# Altium project H2_receiver_v1.PrjPcb
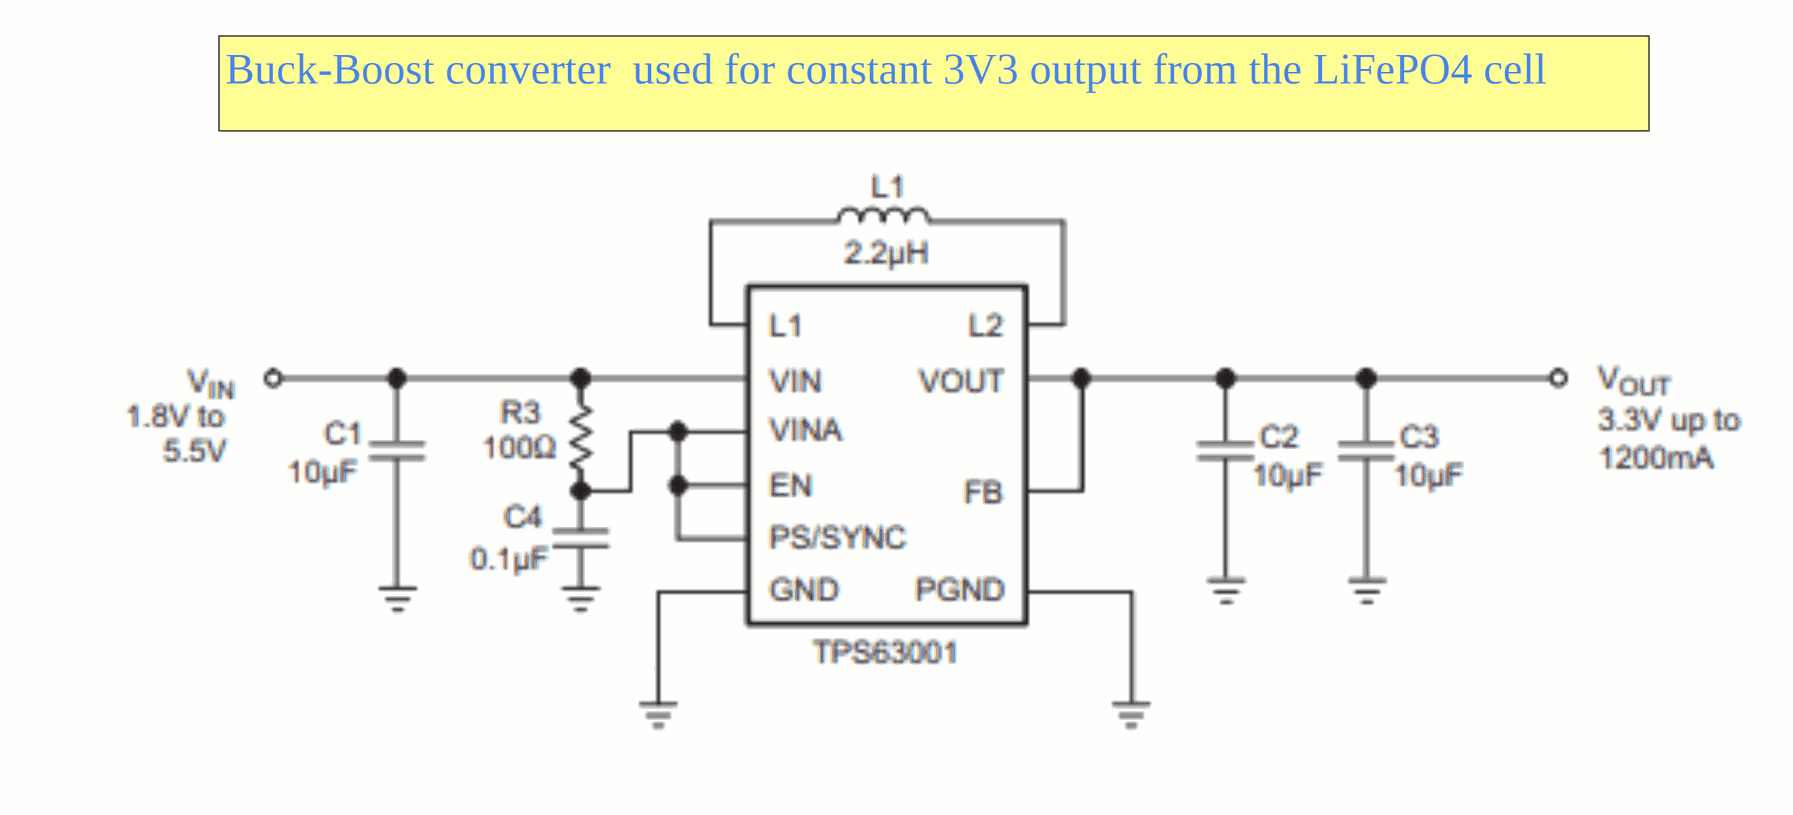
[diagram p0: 1_Power.SchDoc, top left]
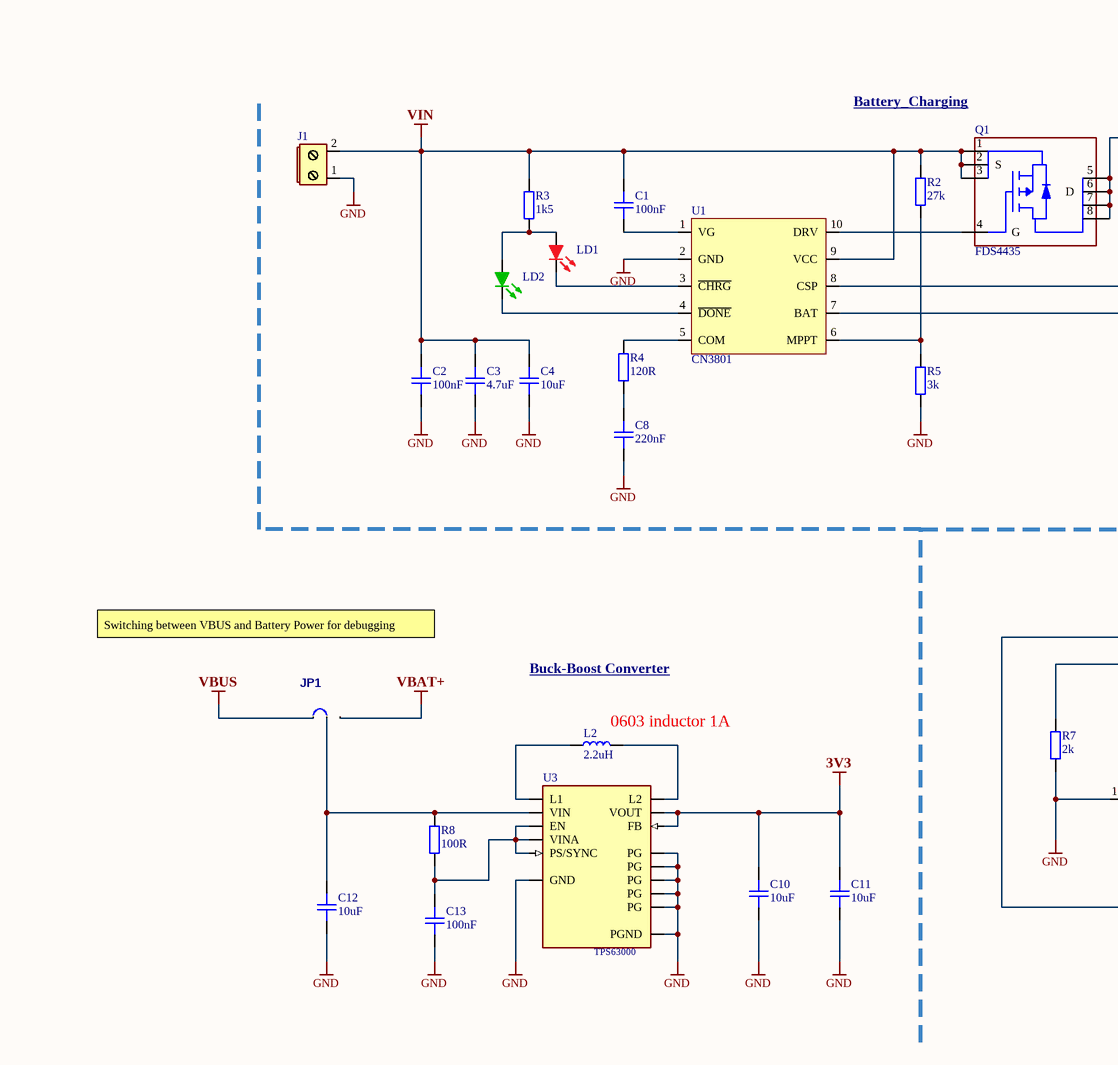
[diagram p1: 1_Power.SchDoc, top middle]
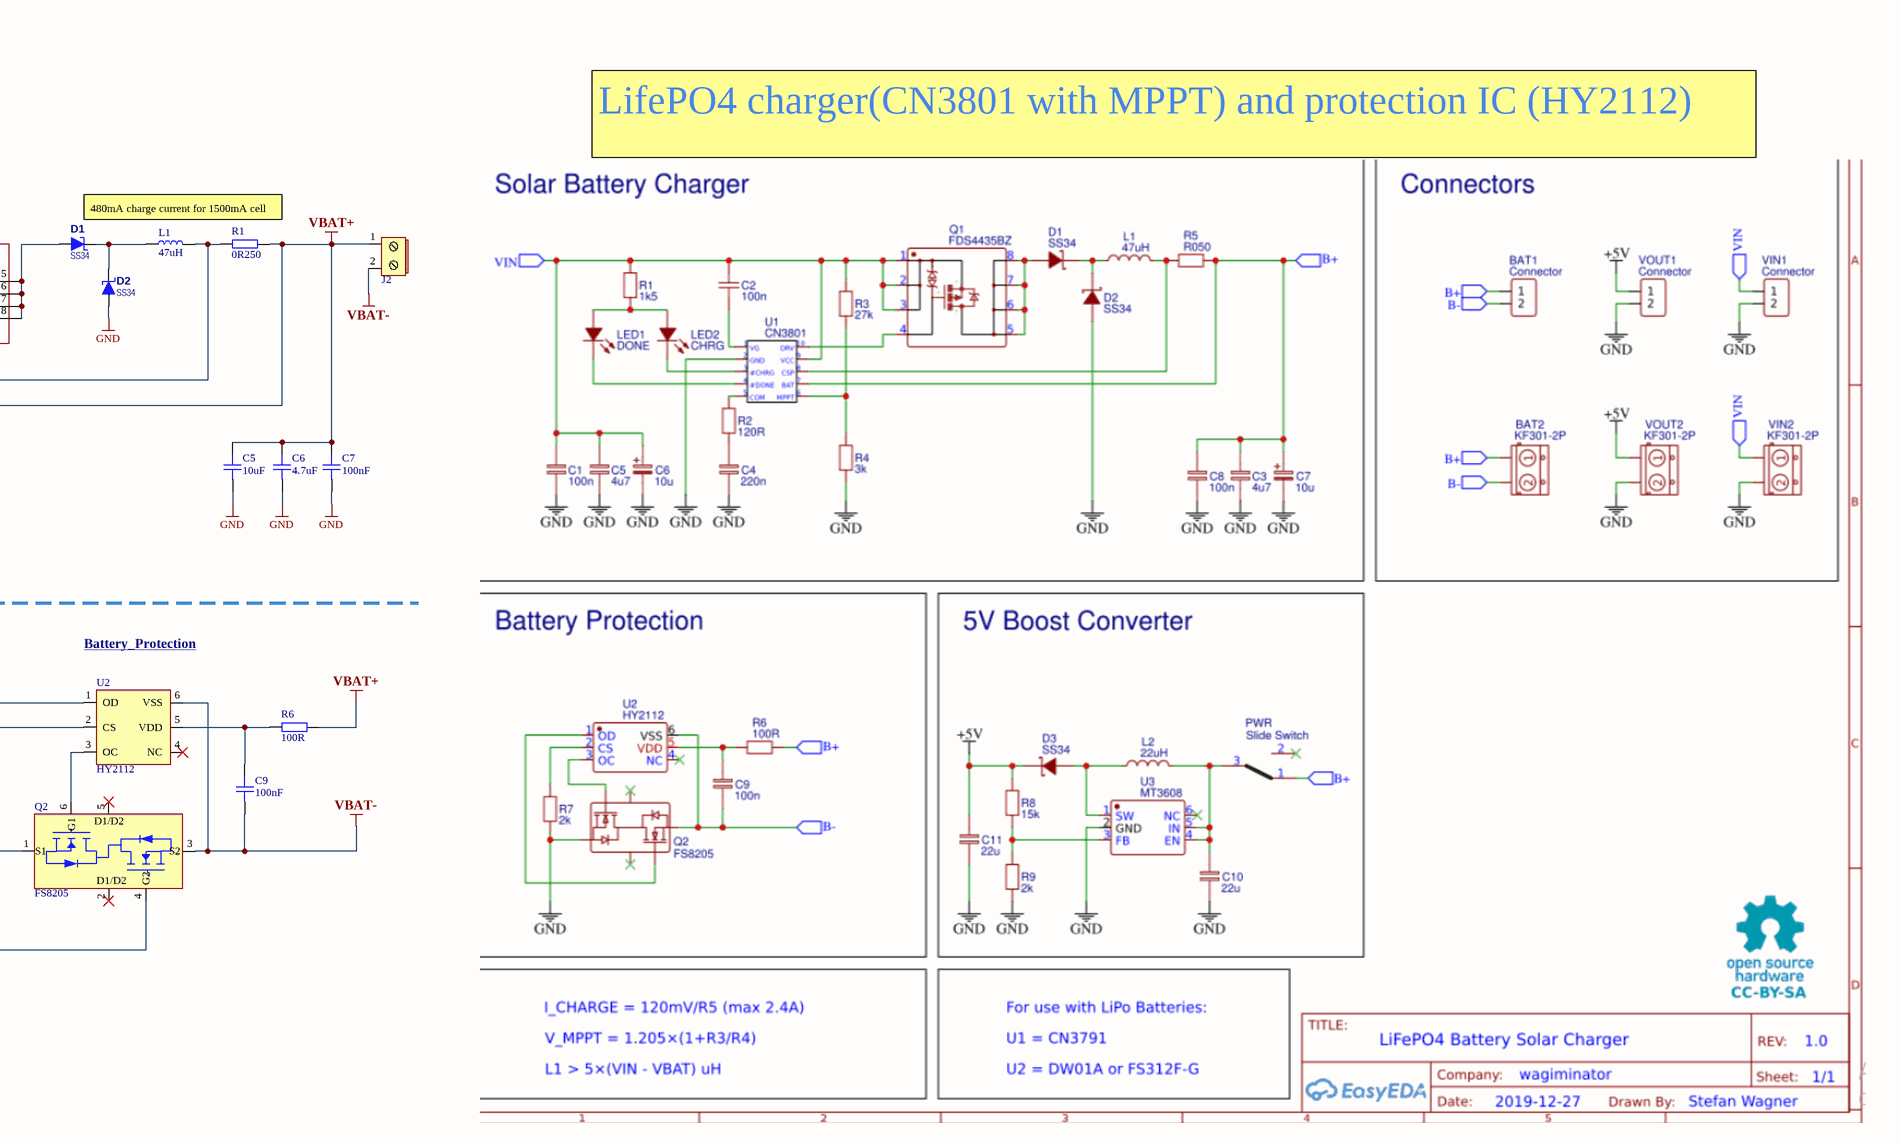
[diagram p2: 1_Power.SchDoc, top right]
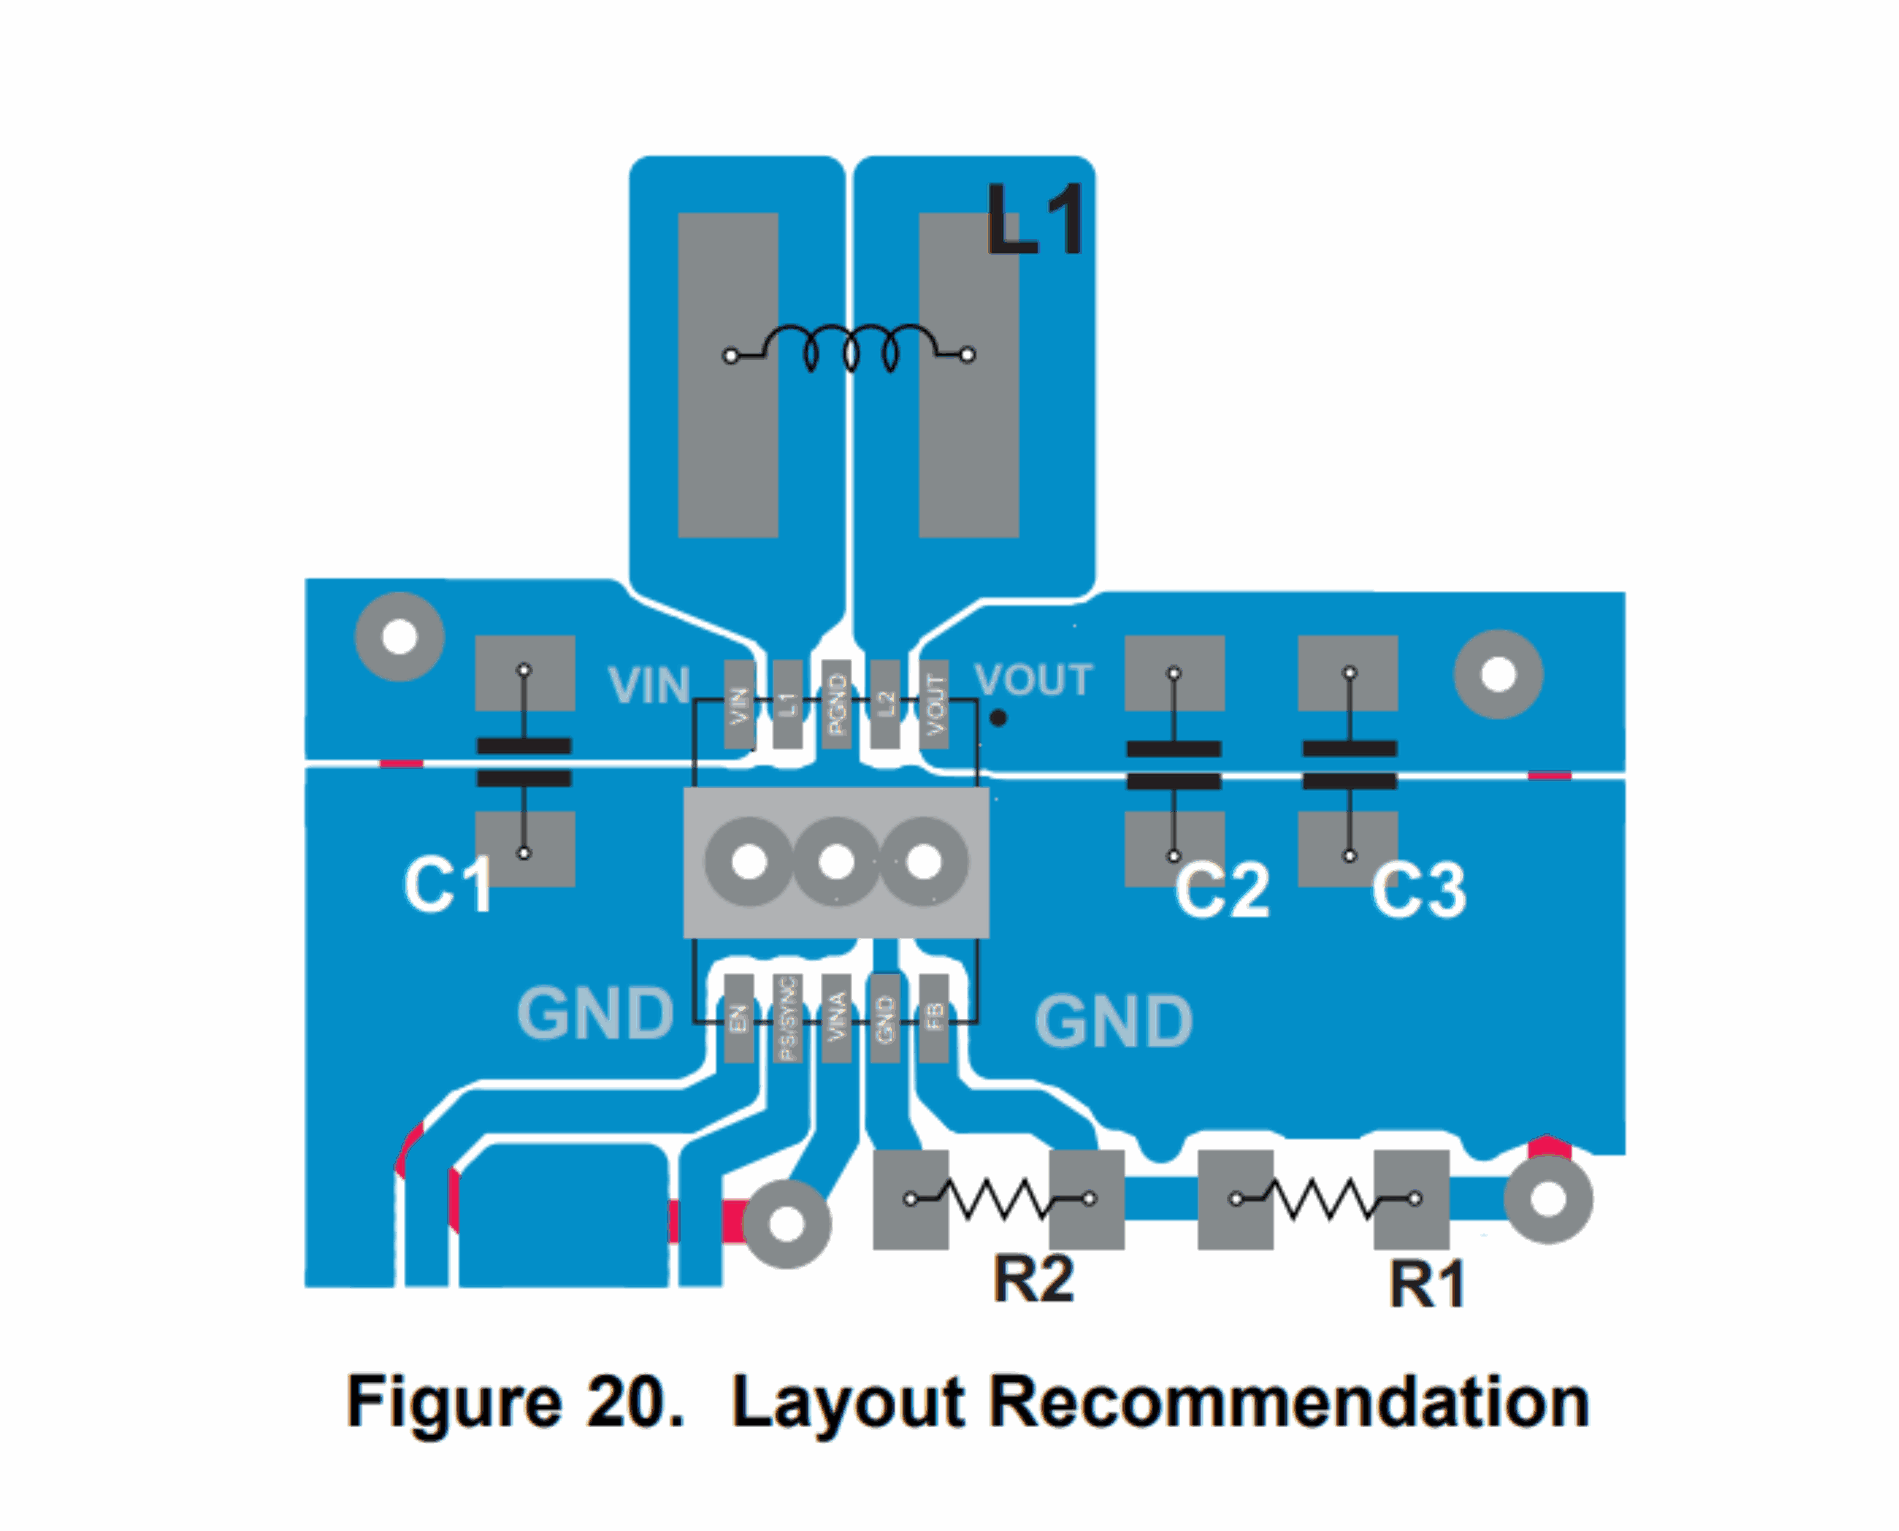
[diagram p3: 1_Power.SchDoc, bottom left]
3 sheets, 67 parts. Net scope: flat (ports and power ports of the same name join across sheets).
Board file: PCB1.PcbDoc
Sheets:
  1_Power.SchDoc
  3_Communication.SchDoc
  4_SD_Card_NFC.SchDoc

## Sheet 1_Power.SchDoc
size A4; SheetNumber: 1; SheetTotal: 4

### Parts
C1  100nF  [C0603]
C2  100nF  [C0603]
C3  4.7uF  [C0603]
C4  10uF  [C0805]
C5  10uF  [C0805]
C6  4.7uF  [C0603]
C7  100nF  [C0603]
C8  220nF  [C0603]
C9  100nF  [C0603]
C10  10uF  [C0805]
C11  10uF  [C0805]
C12  10uF  [C0805]
C13  100nF  [C0603]
D1  SS34  [DO-214AC]
D2  SS34  [DO-214AC]
J1  PLUGIN_TERMINAL  [2.54_pluggable_terminal]  (value not drawn)
J2  PLUGIN_TERMINAL  [HEADER_1x2_2.54]  (value not drawn)
JP1  JUMPER_3PIN  [HEADER_1x3_2.54]  (value not drawn)
L1  47uH  [IND_5_7]
L2  2.2uH  [L0603]
LD1  LED_RED  [LED0603RD]  (value not drawn)
LD2  LED_GREEN  [LED0603GR]  (value not drawn)
Q1  FDS4435  [SOIC-SN8_N]
Q2  FS8205  [SOT23-6]
R1  0R250  [R2512]
R2  27k  [R0603]
R3  1k5  [R0603]
R4  120R  [R0603]
R5  3k  [R0603]
R6  100R  [R0603]
R7  2k  [R0603]
R8  100R  [R0603]
U1  CN3801  [SSOP-10]
U2  HY2112  [SOT23-6]
U3  TPS63000  [VREG_V62/16624-01YE]  (value not drawn)

### Nets
3V3: C10.2 C11.2 U3.1(VOUT) U3.10(FB)
GND: C2.1 C3.1 C4.1 C5.1 C6.1 C7.1 C8.1 C10.1 C11.1 C12.1 C13.1 D2.1(A) J1.1 Q2.1(S1) R5.1 R7.1 U1.2(GND) U3.3(PGND) U3.9(GND) U3.11(PG)
VBAT+: C5.2 C6.2 C7.2 J2.1 JP1.3 R1.2 R6.1 U1.7(BAT)
VBAT-: C9.1 J2.2 Q2.3(S2) U2.6(VSS)
VBUS: JP1.1
VIN: C1.2 C2.2 C3.2 C4.2 J1.2 Q1.1(S) Q1.2(S) Q1.3(S) R2.2 R3.2 U1.9(VCC)
NetC1_1: C1.1 U1.1(VG)
NetC8_2: C8.2 R4.1
NetC9_2: C9.2 R6.2 U2.5(VDD)
NetC12_2: C12.2 JP1.2 R8.2 U3.5(VIN)
NetC13_2: C13.2 R8.1 U3.6(EN) U3.7(PS/SYNC) U3.8(VINA)
NetD1_1: D1.1(A) Q1.5(D) Q1.6(D) Q1.7(D) Q1.8(D)
NetD1_2: D1.2(K) D2.2(K) L1.1
NetL1_2: L1.2 R1.1 U1.8(CSP)
NetL2_1: L2.1 U3.4(L1)
NetL2_2: L2.2 U3.2(L2)
NetLD1_1: LD1.1(A) LD2.1(A) R3.1
NetLD1_2: LD1.2(K) U1.3(~{CHRG})
NetLD2_2: LD2.2(K) U1.4(~{DONE})
NetQ1_4: Q1.4(G) U1.10(DRV)
NetQ2_4: Q2.4(G2) U2.1(OD)
NetQ2_6: Q2.6(G1) U2.3(OC)
NetR2_1: R2.1 R5.2 U1.6(MPPT)
NetR4_2: R4.2 U1.5(COM)
NetR7_2: R7.2 U2.2(CS)

Not connected (* = marked no-connect by the designer): Q2 2(D1/D2)* 5(D1/D2)*; U2 4(NC)*

### Notes on the sheet
- Buck-Boost converter  used for constant 3V3 output from the LiFePO4 cell
- LifePO4 charger(CN3801 with MPPT) and protection IC (HY2112)
- Battery_Charging
- 480mA charge current for 1500mA cell
- Switching between VBUS and Battery Power for debugging
- Battery_Protection
- Overcharge, Overdischarge, Overcurrent, Short-circuit protection
- Buck-Boost Converter
- (near L2) 0603 inductor 1A

### Library data of the parts
C1-C3 C6-C9 C13 = CAP_0603: Capacitor SMD 0603; Manufacturer: *; Manufacturer Part Number: *; Distributor Link: *; LCSC: *; Rating: *; Dielectric: *
C4 C5 C10-C12 = CAP_0805: Capacitor SMD 0805; Manufacturer: *; Manufacturer Part Number: *; Distributor Link: *; LCSC: *; Rating: *; Dielectric: *
D1 D2 = DIODE_SCHOTTKY: Diode; Manufacturer Part Number 1: *; PackageReference: *
J1 J2 = Power_Connector: Screw terminal or plug terminal for power
JP1 = JUMPER_3PIN: *; PackageReference: *; Manufacturer Part Number 1: *
L1 = IND_0603: Inductor SMD 0603
L2 = IND_1008: Inductor SMD 1008
LD1 = LED_RED: Typical BLUE SiC LED; Published: 8-Jun-2000; LatestRevisionDate: 17-Dec-2003; LatestRevisionNote: PCB Footprint replaced.; DatasheetVersion: 16-Apr-2002; PackageVersion: 16-Apr-2002; Publisher: Altium Limited; PackageDescription: SM LED; 2 C-Bend Leads; Body 3.5 x 2.8 x 1.9 mm, inc leads (LxWxH typ); Manufacturer Part Number 1: *; PackageReference: 3.5X2.8X1.9
LD2 = LED_GREEN: Typical BLUE SiC LED; Published: 8-Jun-2000; LatestRevisionDate: 17-Dec-2003; LatestRevisionNote: PCB Footprint replaced.; DatasheetVersion: 16-Apr-2002; PackageVersion: 16-Apr-2002; Publisher: Altium Limited; PackageDescription: SM LED; 2 C-Bend Leads; Body 3.5 x 2.8 x 1.9 mm, inc leads (LxWxH typ); Manufacturer Part Number 1: *; PackageReference: 3.5X2.8X1.9
R1 = RES_0805: Resistor SMD 0805; Manufacturer: *; Manufacturer Part Number: *; Distributor Link: *; LCSC: *
R2-R6 R8 = RES_0603: Resistor SMD 0603; Manufacturer: *; Manufacturer Part Number: *; Distributor Link: *; LCSC: *
R7 = RES_0603_1: Resistor SMD 0603; Manufacturer: *; Manufacturer Part Number: *; Distributor Link: *; LCSC: *
U1 = CN3801: LiFePO4 charge IC with integrated MPPT and wide input range (4.5 to 28V) with deeply discharged cell revive
U2 = HY2112: LiFePO4 protection IC
U3 = TPS63000: Buck-Boost Switching Regulator IC Positive Adjustable 1.2V 1 Output 1.6A _Switch_ 10-VFDFN Exposed Pad; MF: Texas Instruments; Package: QFN-10 Texas Instruments; SnapEDA_Link: https://www.snapeda.com/parts/TPS63000/Texas%20Instruments/view-part/572521/?ref=snap; MP: TPS63000; Value: *; Availability: Unavailable; Price: None

## Sheet 3_Communication.SchDoc
size A4; SheetNumber: 3; SheetTotal: 4
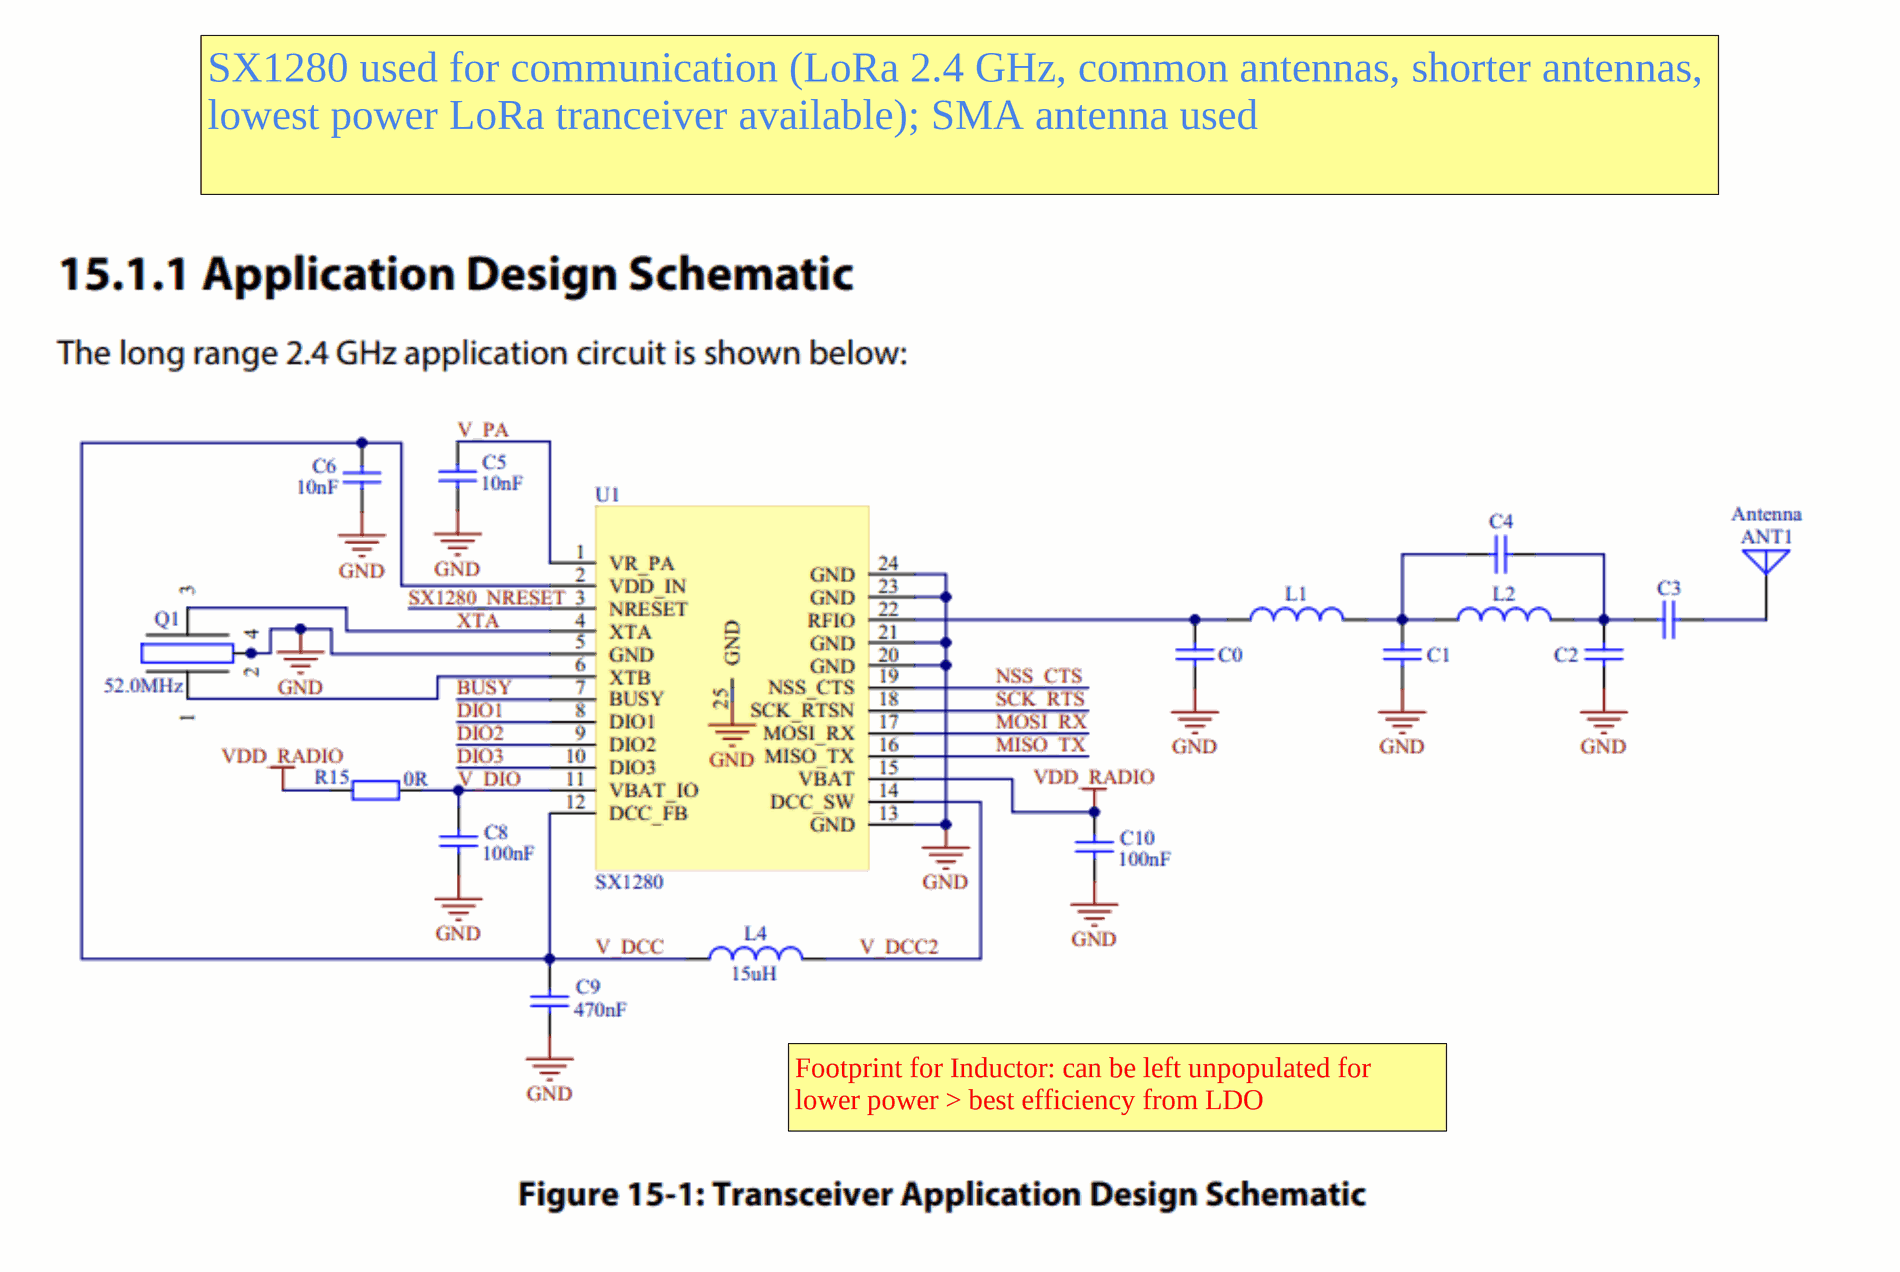
[diagram p4: 3_Communication.SchDoc, left]
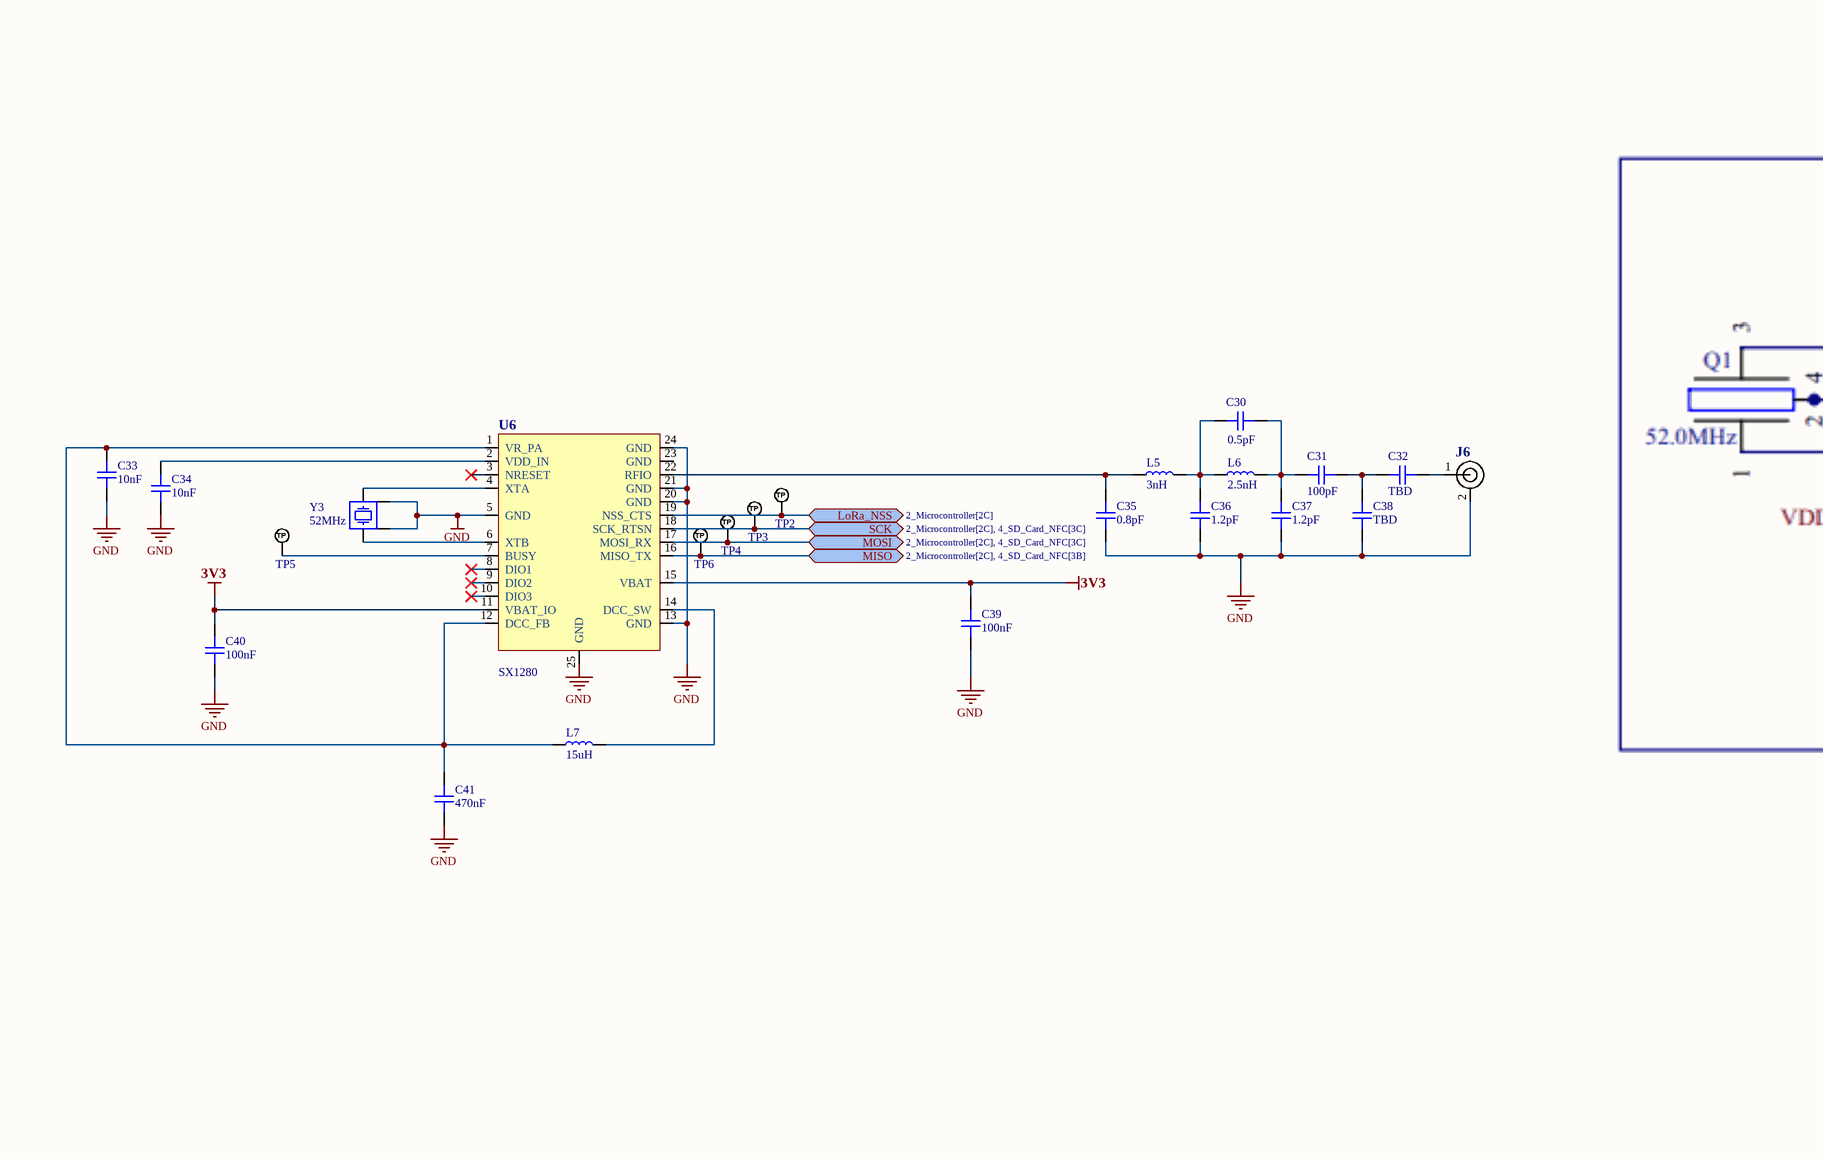
[diagram p5: 3_Communication.SchDoc, middle]
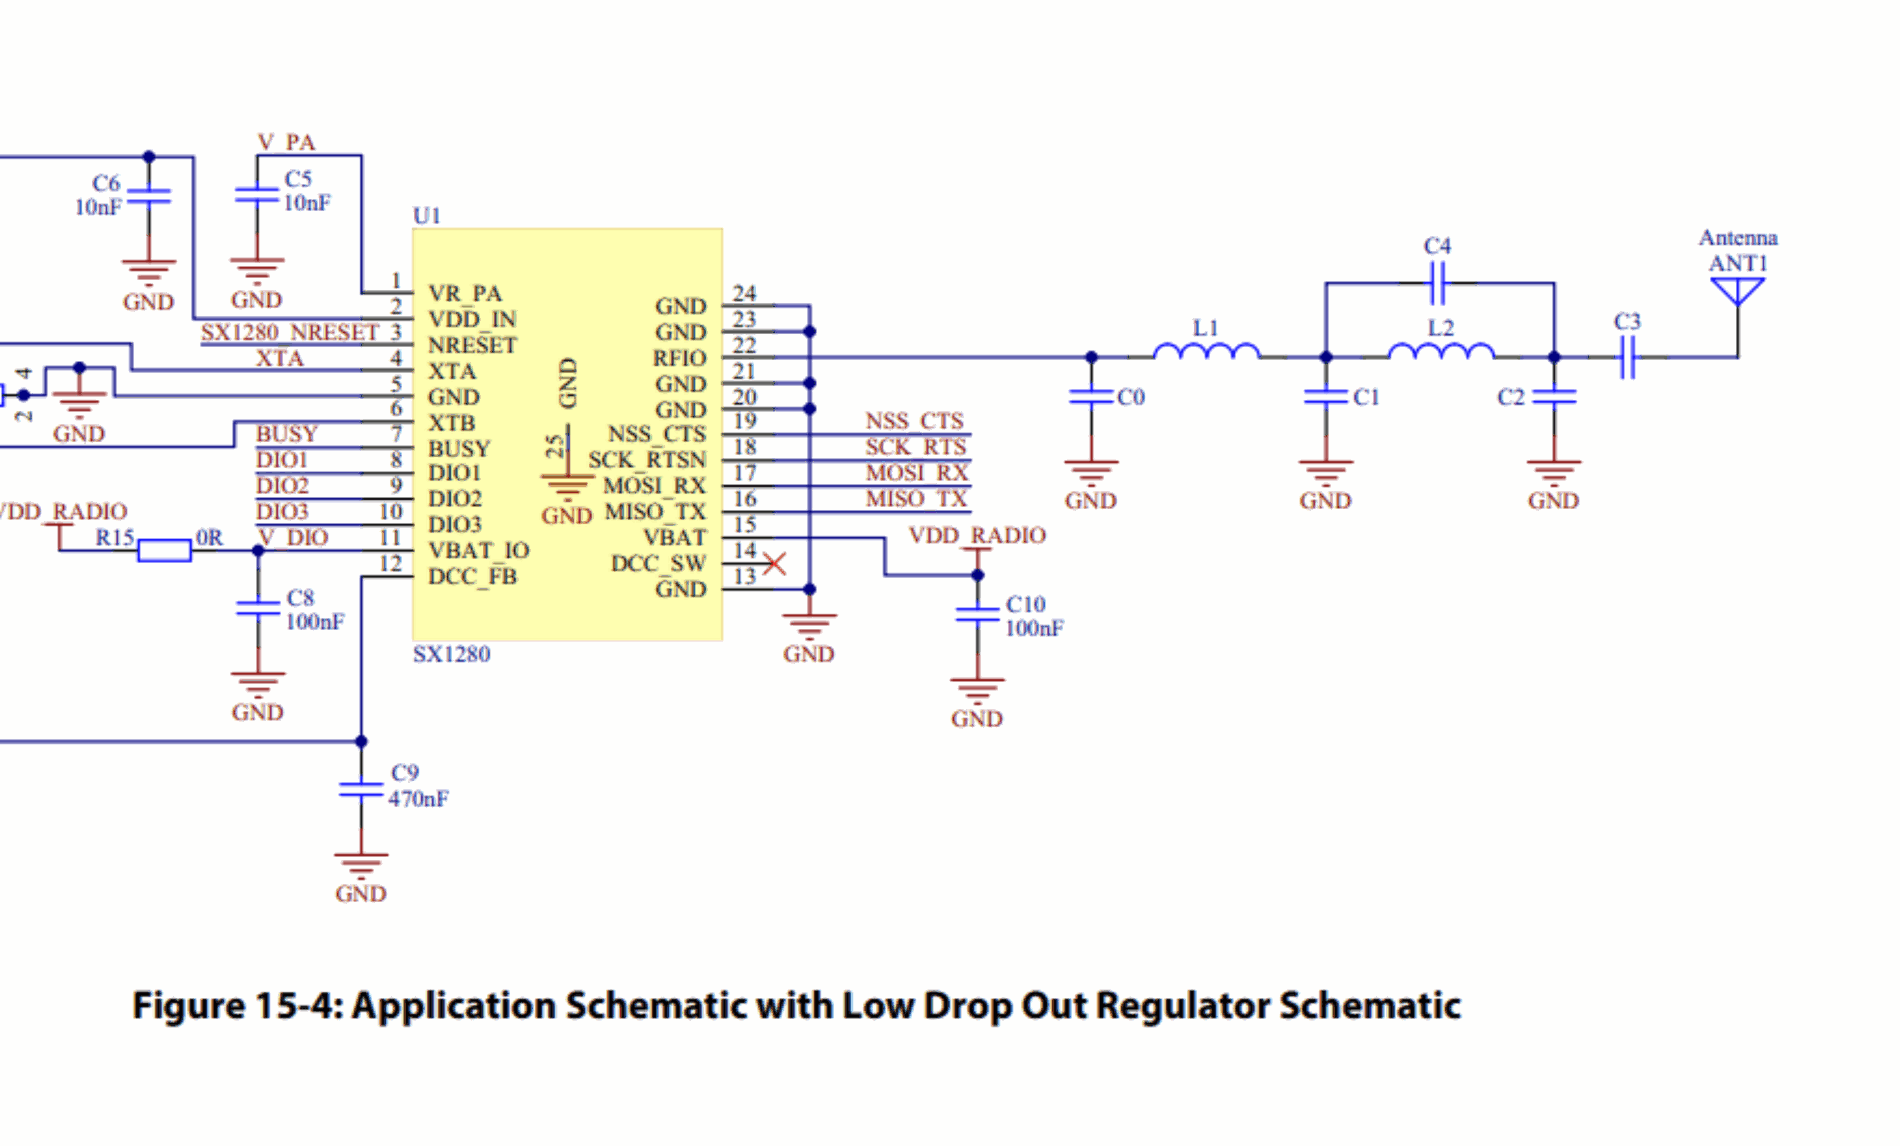
[diagram p6: 3_Communication.SchDoc, right]

### Parts
C30  0.5pF  [C0603]
C31  100pF  [C0603]
C32  TBD  [C0603]
C33  10nF  [C0603]
C34  10nF  [C0603]
C35  0.8pF  [C0603]
C36  1.2pF  [C0603]
C37  1.2pF  [C0603]
C38  TBD  [C0603]
C39  100nF  [C0603]
C40  100nF  [C0603]
C41  470nF  [C0603]
J6  SMA_EDGE_CONN  [CON_SMA-EDGE-S]  (value not drawn)
L5  3nH  [L0603]
L6  2.5nH  [L0603]
L7  15uH  [IND_3.2_4]
TP2  TP_NOBOM  [TEST_PAD_THD]  (value not drawn)  (no BOM)
TP3  TP_NOBOM  [TEST_PAD_THD]  (value not drawn)  (no BOM)
TP4  TP_NOBOM  [TEST_PAD_THD]  (value not drawn)  (no BOM)
TP5  TP_NOBOM  [TEST_PAD_THD]  (value not drawn)  (no BOM)
TP6  TP_NOBOM  [TEST_PAD_THD]  (value not drawn)  (no BOM)
U6  SX1280  [QFN-24_4x4_0.5]
Y3  52MHz  [CRYSTAL_2016_4P]

### Ports
LoRa_NSS (bidir, see 2_Microcontroller[2C]), MISO (bidir, see 2_Microcontroller[2C], 4_SD_Card_NFC[3B]), MOSI (bidir, see 2_Microcontroller[2C], 4_SD_Card_NFC[3C]), SCK (bidir, see 2_Microcontroller[2C], 4_SD_Card_NFC[3C])

### Nets
3V3: C39.2 C40.2 U6.11(VBAT_IO) U6.15(VBAT)
GND: C33.1 C34.1 C35.1 C36.1 C37.1 C38.1 C39.1 C40.1 C41.1 J6.2 U6.5(GND) U6.13(GND) U6.20(GND) U6.21(GND) U6.24(GND) U6.25(GND) Y3.2 Y3.4
NetC30_1: C30.1 C31.2 C37.2 L6.2
NetC30_2: C30.2 C36.2 L5.2 L6.1
NetC31_1: C31.1 C32.2 C38.2
NetC32_1: C32.1 J6.1
NetC33_2: C33.2 C41.2 L7.1 U6.1(VR_PA) U6.12(DCC_FB)
NetC34_2: C34.2 U6.2(VDD_IN)
NetC35_2: C35.2 L5.1 U6.22(RFIO)
NetJ7_3: TP4.1(TP) U6.17(MOSI_RX) ; port MOSI
NetJ7_5: TP3.1(TP) U6.18(SCK_RTSN) ; port SCK
NetJ7_7: TP6.1(TP) U6.16(MISO_TX) ; port MISO
NetL7_2: L7.2 U6.14(DCC_SW)
NetTP2_1: TP2.1(TP) U6.19(NSS_CTS) ; port LoRa_NSS
NetTP5_1: TP5.1(TP) U6.7(BUSY)
NetU6_4: U6.4(XTA) Y3.3
NetU6_6: U6.6(XTB) Y3.1

Not connected (* = marked no-connect by the designer): U6 3(NRESET)* 8(DIO1)* 9(DIO2)* 10(DIO3)* 23(GND)

### Notes on the sheet
- SX1280 used for communication (LoRa 2.4 GHz, common antennas, shorter antennas, lowest power LoRa tranceiver available); SMA antenna used
- impedance matching configurations(40R to 50R after C25)
- last 2 capacitors are for impedance matching for certain antenna
- Values based on antenna input impedance; capacitors to ground can be left unpopullated, inductors or series capacitors can be swaped with 0R resistors or shunts
- Footprint for Inductor: can be left unpopulated for lower power > best efficiency from LDO

### Library data of the parts
C30 C31 C33 C34 C36 C37 C39-C41 = CAP_0603: Capacitor SMD 0603; Manufacturer: *; Manufacturer Part Number: *; Distributor Link: *; LCSC: *; Rating: *; Dielectric: *
C32 C38 = CAP_0603: Capacitor SMD 0805; Manufacturer: *; Manufacturer Part Number: *; Distributor Link: *; LCSC: *; Rating: *; Dielectric: *
C35 = CAP_0805: Capacitor SMD 0805; Manufacturer: *; Manufacturer Part Number: *; Distributor Link: *; LCSC: *; Rating: *; Dielectric: *
J6 = CON-SMA-EDGE-S: RF Connector SMA Female 50 Ohms 18 GHz PCB Edge Mount; Manufacturer: RF Solutions; Manufacturer Part Number: CON-SMA-EDGE-S
L5-L7 = IND_0603: Inductor SMD 0603
TP2-TP6 = TEST_POINT_RND_1MM: Test Point Round 1mm (NO BOM)
U6 = SX1280: Low power LoRa transceiver operating at 2.4GHz with ranging capability
Y3 = Crystal: Manufacturer: Epson; Manufacturer Part Number: TSX-3225 24.0000MF15X-AC

## Sheet 4_SD_Card_NFC.SchDoc
size A4; SheetNumber: 4; SheetTotal: 4
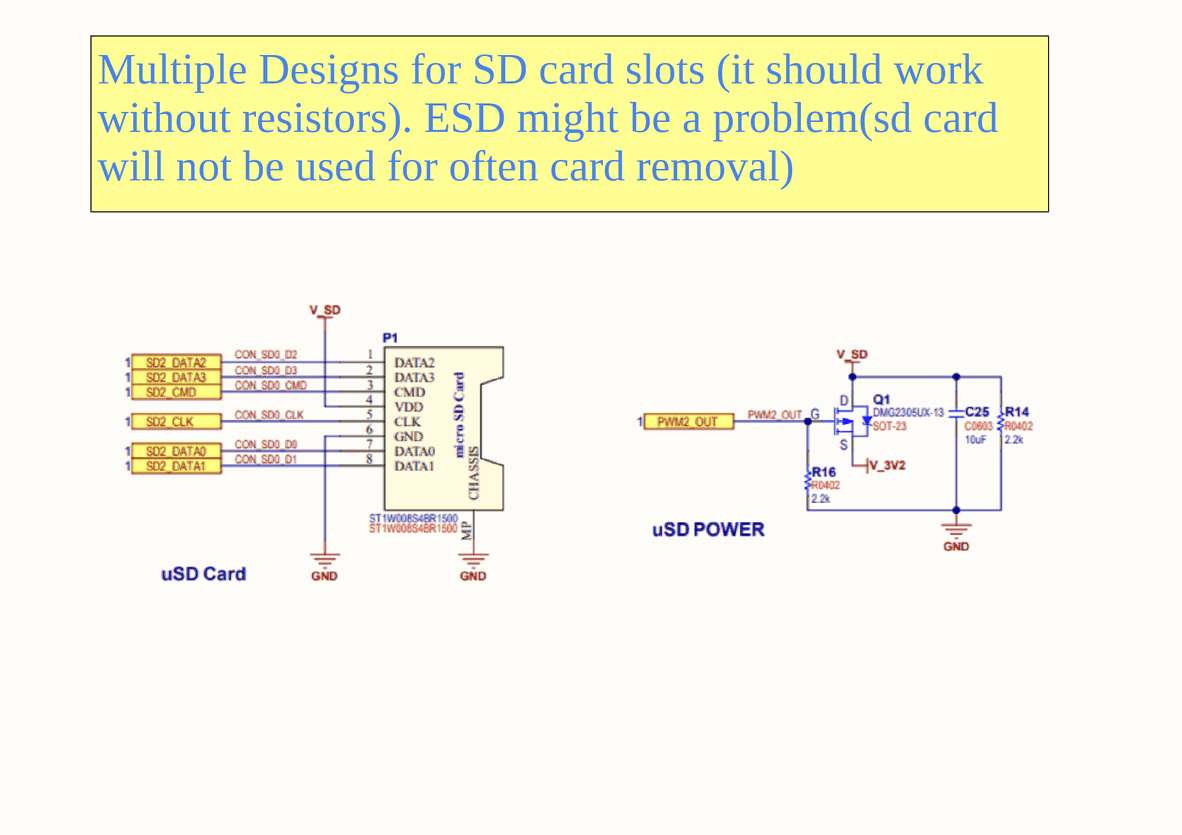
[diagram p7: 4_SD_Card_NFC.SchDoc, top middle]
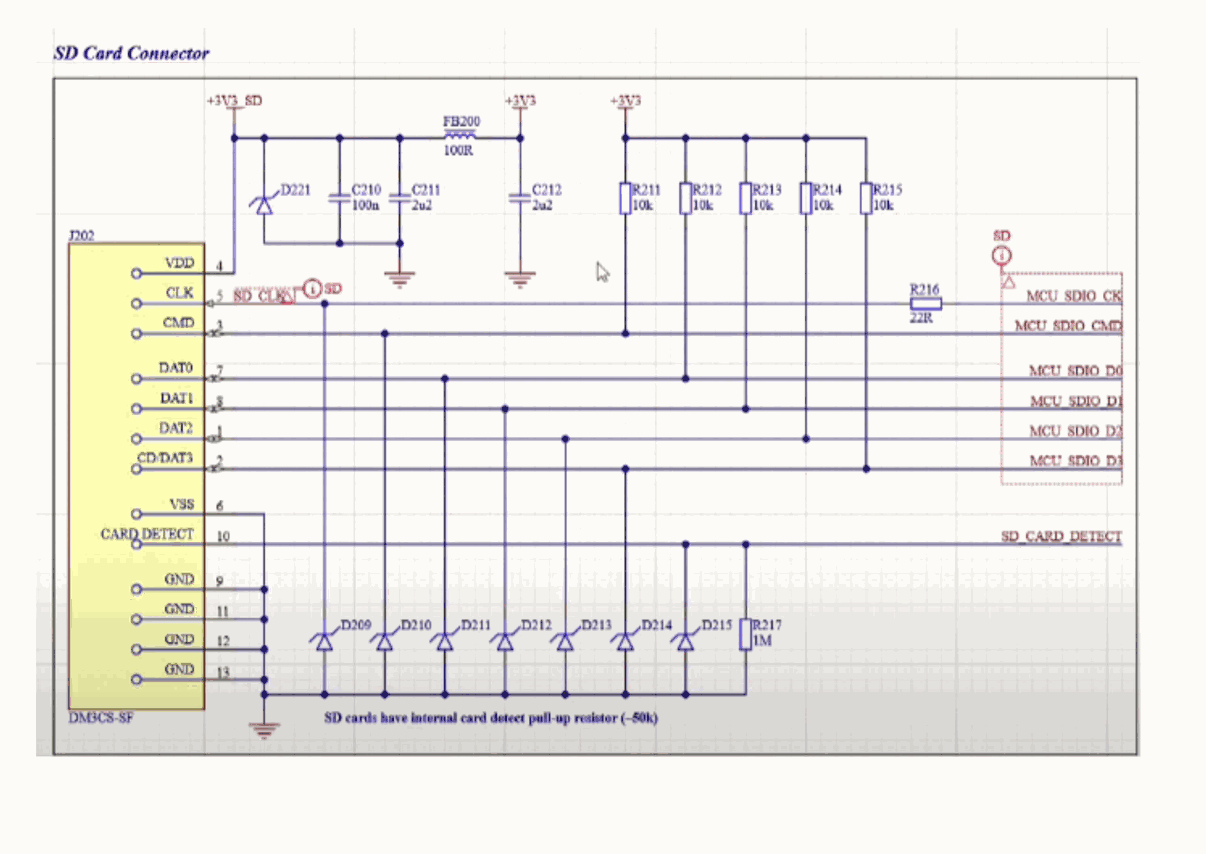
[diagram p8: 4_SD_Card_NFC.SchDoc, bottom left]
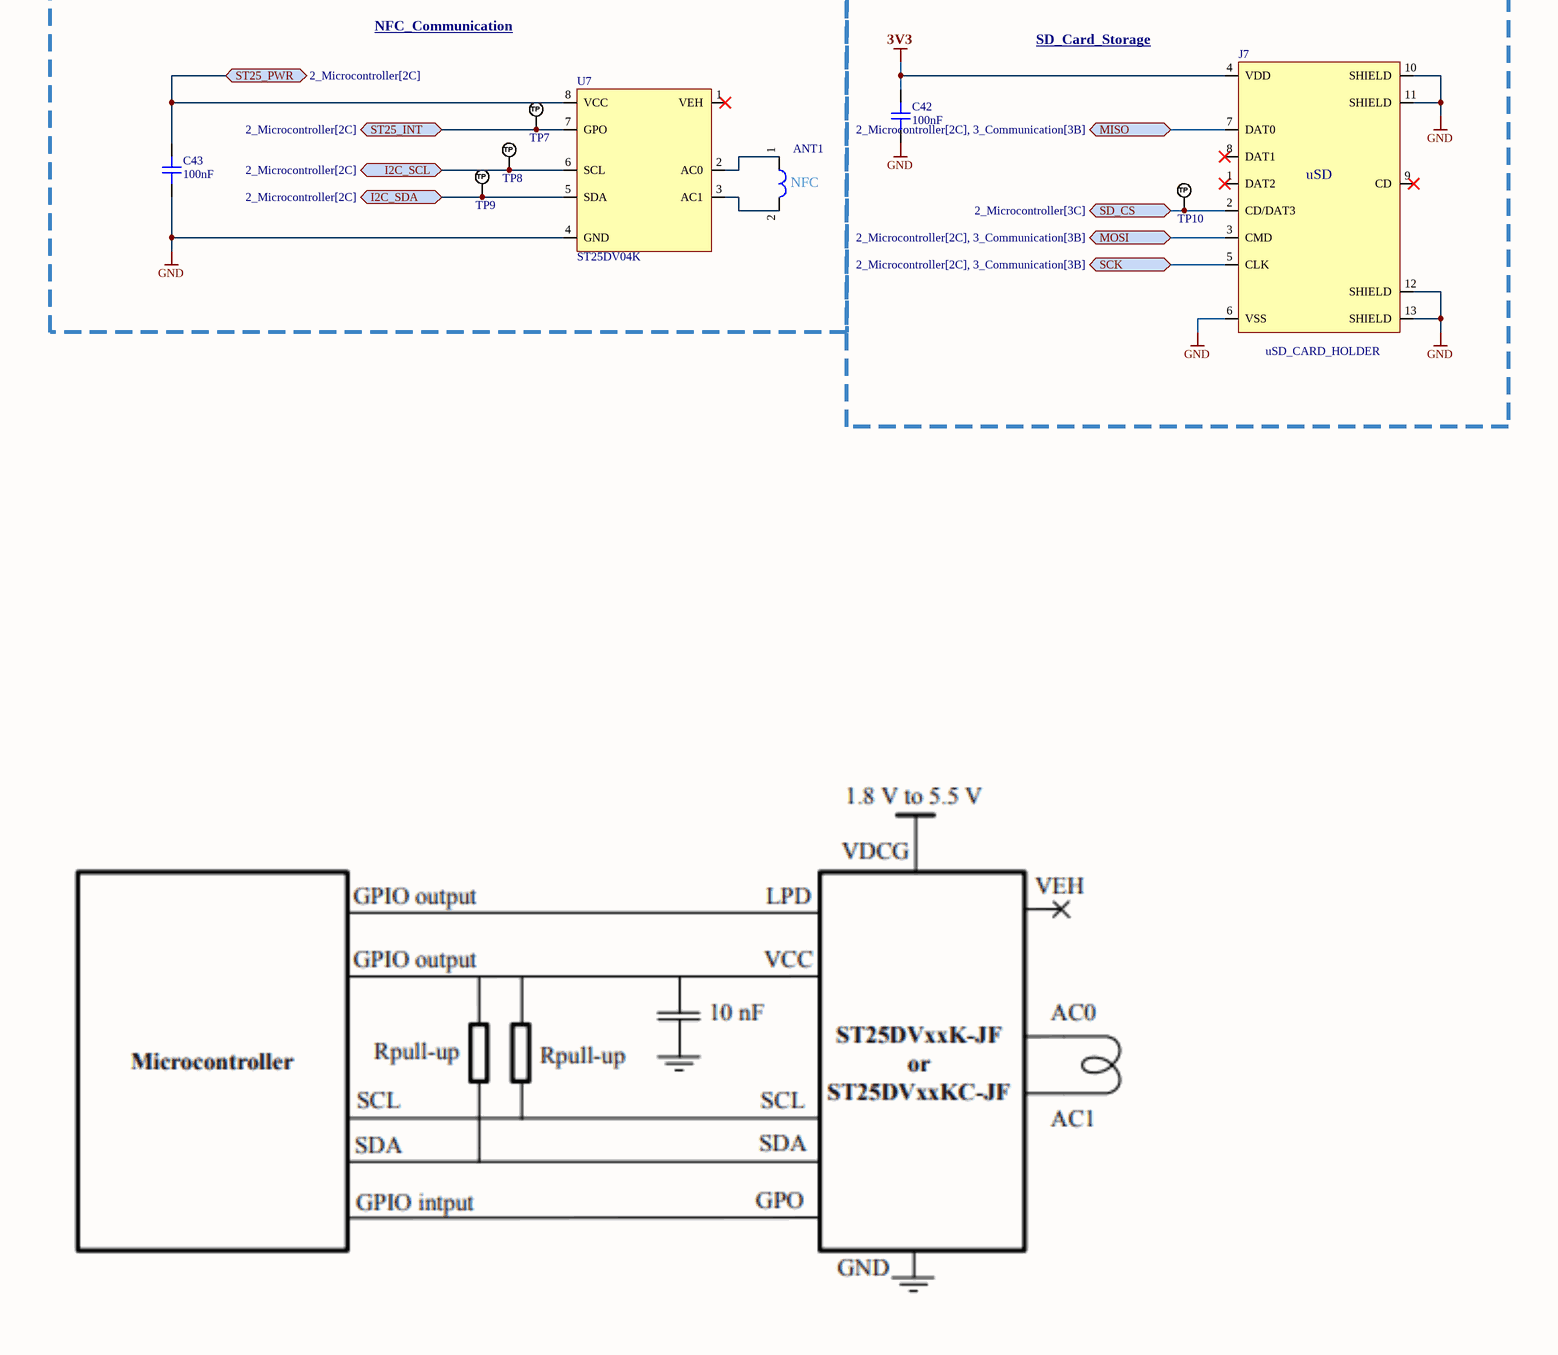
[diagram p9: 4_SD_Card_NFC.SchDoc, bottom middle]
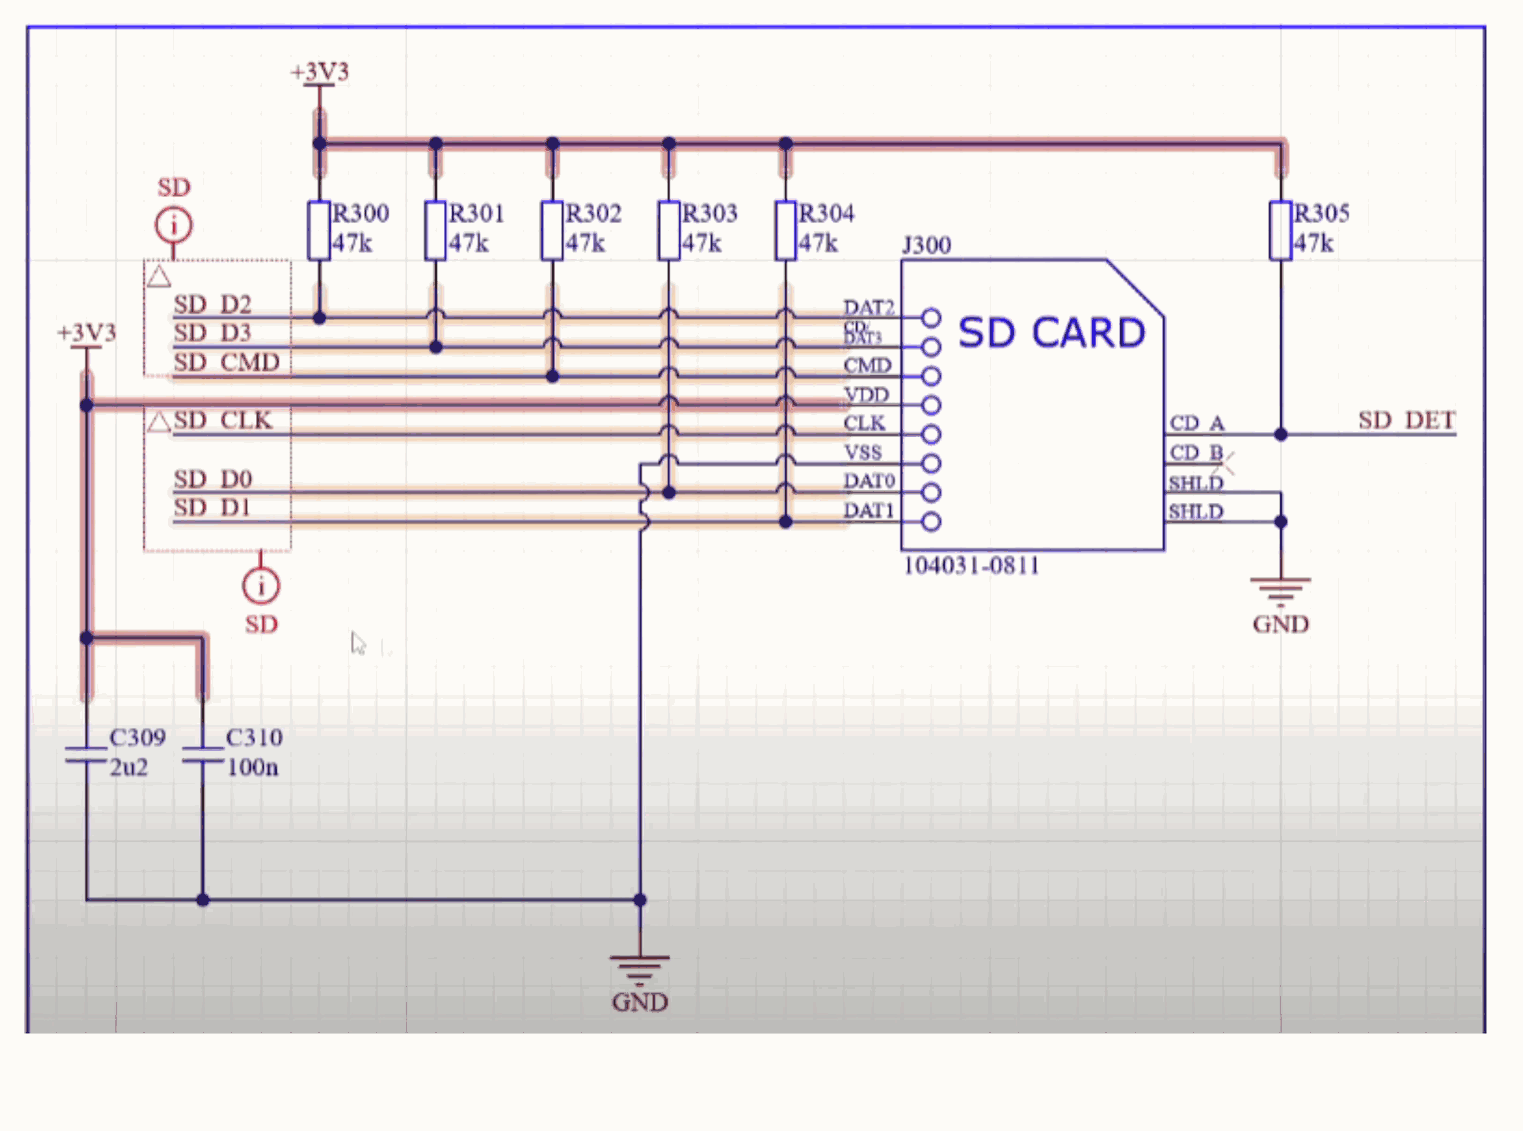
[diagram p10: 4_SD_Card_NFC.SchDoc, bottom right]

### Parts
ANT1  NFC_ANTENNA  [ANT16]  (value not drawn)
C42  100nF  [C0603]
C43  100nF  [C0603]
J7  uSD_CARD_HOLDER  [TF115BCP9]
TP7  TP_NOBOM  [TEST_PAD_THD]  (value not drawn)  (no BOM)
TP8  TP_NOBOM  [TEST_PAD_THD]  (value not drawn)  (no BOM)
TP9  TP_NOBOM  [TEST_PAD_THD]  (value not drawn)  (no BOM)
TP10  TP_NOBOM  [TEST_PAD_THD]  (value not drawn)  (no BOM)
U7  ST25DV04K  [SOIC-SN8_N]

### Ports
I2C_SCL (bidir, see 2_Microcontroller[2C]), I2C_SDA (bidir, see 2_Microcontroller[2C]), MISO (bidir, see 2_Microcontroller[2C], 3_Communication[3B]), MOSI (bidir, see 2_Microcontroller[2C], 3_Communication[3B]), SCK (bidir, see 2_Microcontroller[2C], 3_Communication[3B]), SD_CS (bidir, see 2_Microcontroller[3C]), ST25_INT (bidir, see 2_Microcontroller[2C]), ST25_PWR (bidir, see 2_Microcontroller[2C])

### Nets
3V3: C42.2 J7.4(VDD)
GND: C42.1 C43.1 J7.6(VSS) J7.10(SHIELD) J7.11(SHIELD) J7.12(SHIELD) J7.13(SHIELD) U7.4(GND)
NetANT1_1: ANT1.1 U7.2(AC0)
NetANT1_2: ANT1.2 U7.3(AC1)
NetC43_2: C43.2 U7.8(VCC) ; port ST25_PWR
NetJ7_2: J7.2(CD/DAT3) TP10.1(TP) ; port SD_CS
NetJ7_3: J7.3(CMD) ; port MOSI
NetJ7_5: J7.5(CLK) ; port SCK
NetJ7_7: J7.7(DAT0) ; port MISO
NetTP7_1: TP7.1(TP) U7.7(GPO) ; port ST25_INT
NetTP8_1: TP8.1(TP) U7.6(SCL) ; port I2C_SCL
NetTP9_1: TP9.1(TP) U7.5(SDA) ; port I2C_SDA

Not connected (* = marked no-connect by the designer): J7 1(DAT2)* 8(DAT1)* 9(CD)*; U7 1(VEH)*

### Notes on the sheet
- Multiple Designs for SD card slots (it should work without resistors). ESD might be a problem(sd card will not be used for often card removal)
- NFC_Communication
- SD_Card_Storage
- (in symbol NFC_ANTENNA) NFC
- (in symbol uSD_CARD) uSD

### Library data of the parts
C42 C43 = CAP_0603: Capacitor SMD 0603; Manufacturer: *; Manufacturer Part Number: *; Distributor Link: *; LCSC: *; Rating: *; Dielectric: *
J7 = uSD_CARD
TP7-TP10 = TEST_POINT_RND_1MM: Test Point Round 1mm (NO BOM)
U7 = ST25DV04K: ST25DO4K NFC module with I2C

## Nets that join several sheets
3V3: 1_Power (C10.2 C11.2 U3.1 U3.10), 3_Communication (C39.2 C40.2 U6.11 U6.15), 4_SD_Card_NFC (C42.2 J7.4)
GND: 1_Power (20 pins), 3_Communication (18 pins), 4_SD_Card_NFC (8 pins)
NetJ7_3: 3_Communication (TP4.1 U6.17), 4_SD_Card_NFC (J7.3)
NetJ7_5: 3_Communication (TP3.1 U6.18), 4_SD_Card_NFC (J7.5)
NetJ7_7: 3_Communication (TP6.1 U6.16), 4_SD_Card_NFC (J7.7)